# EAGLE design CANreader-XL (EAGLE 7.6.0)
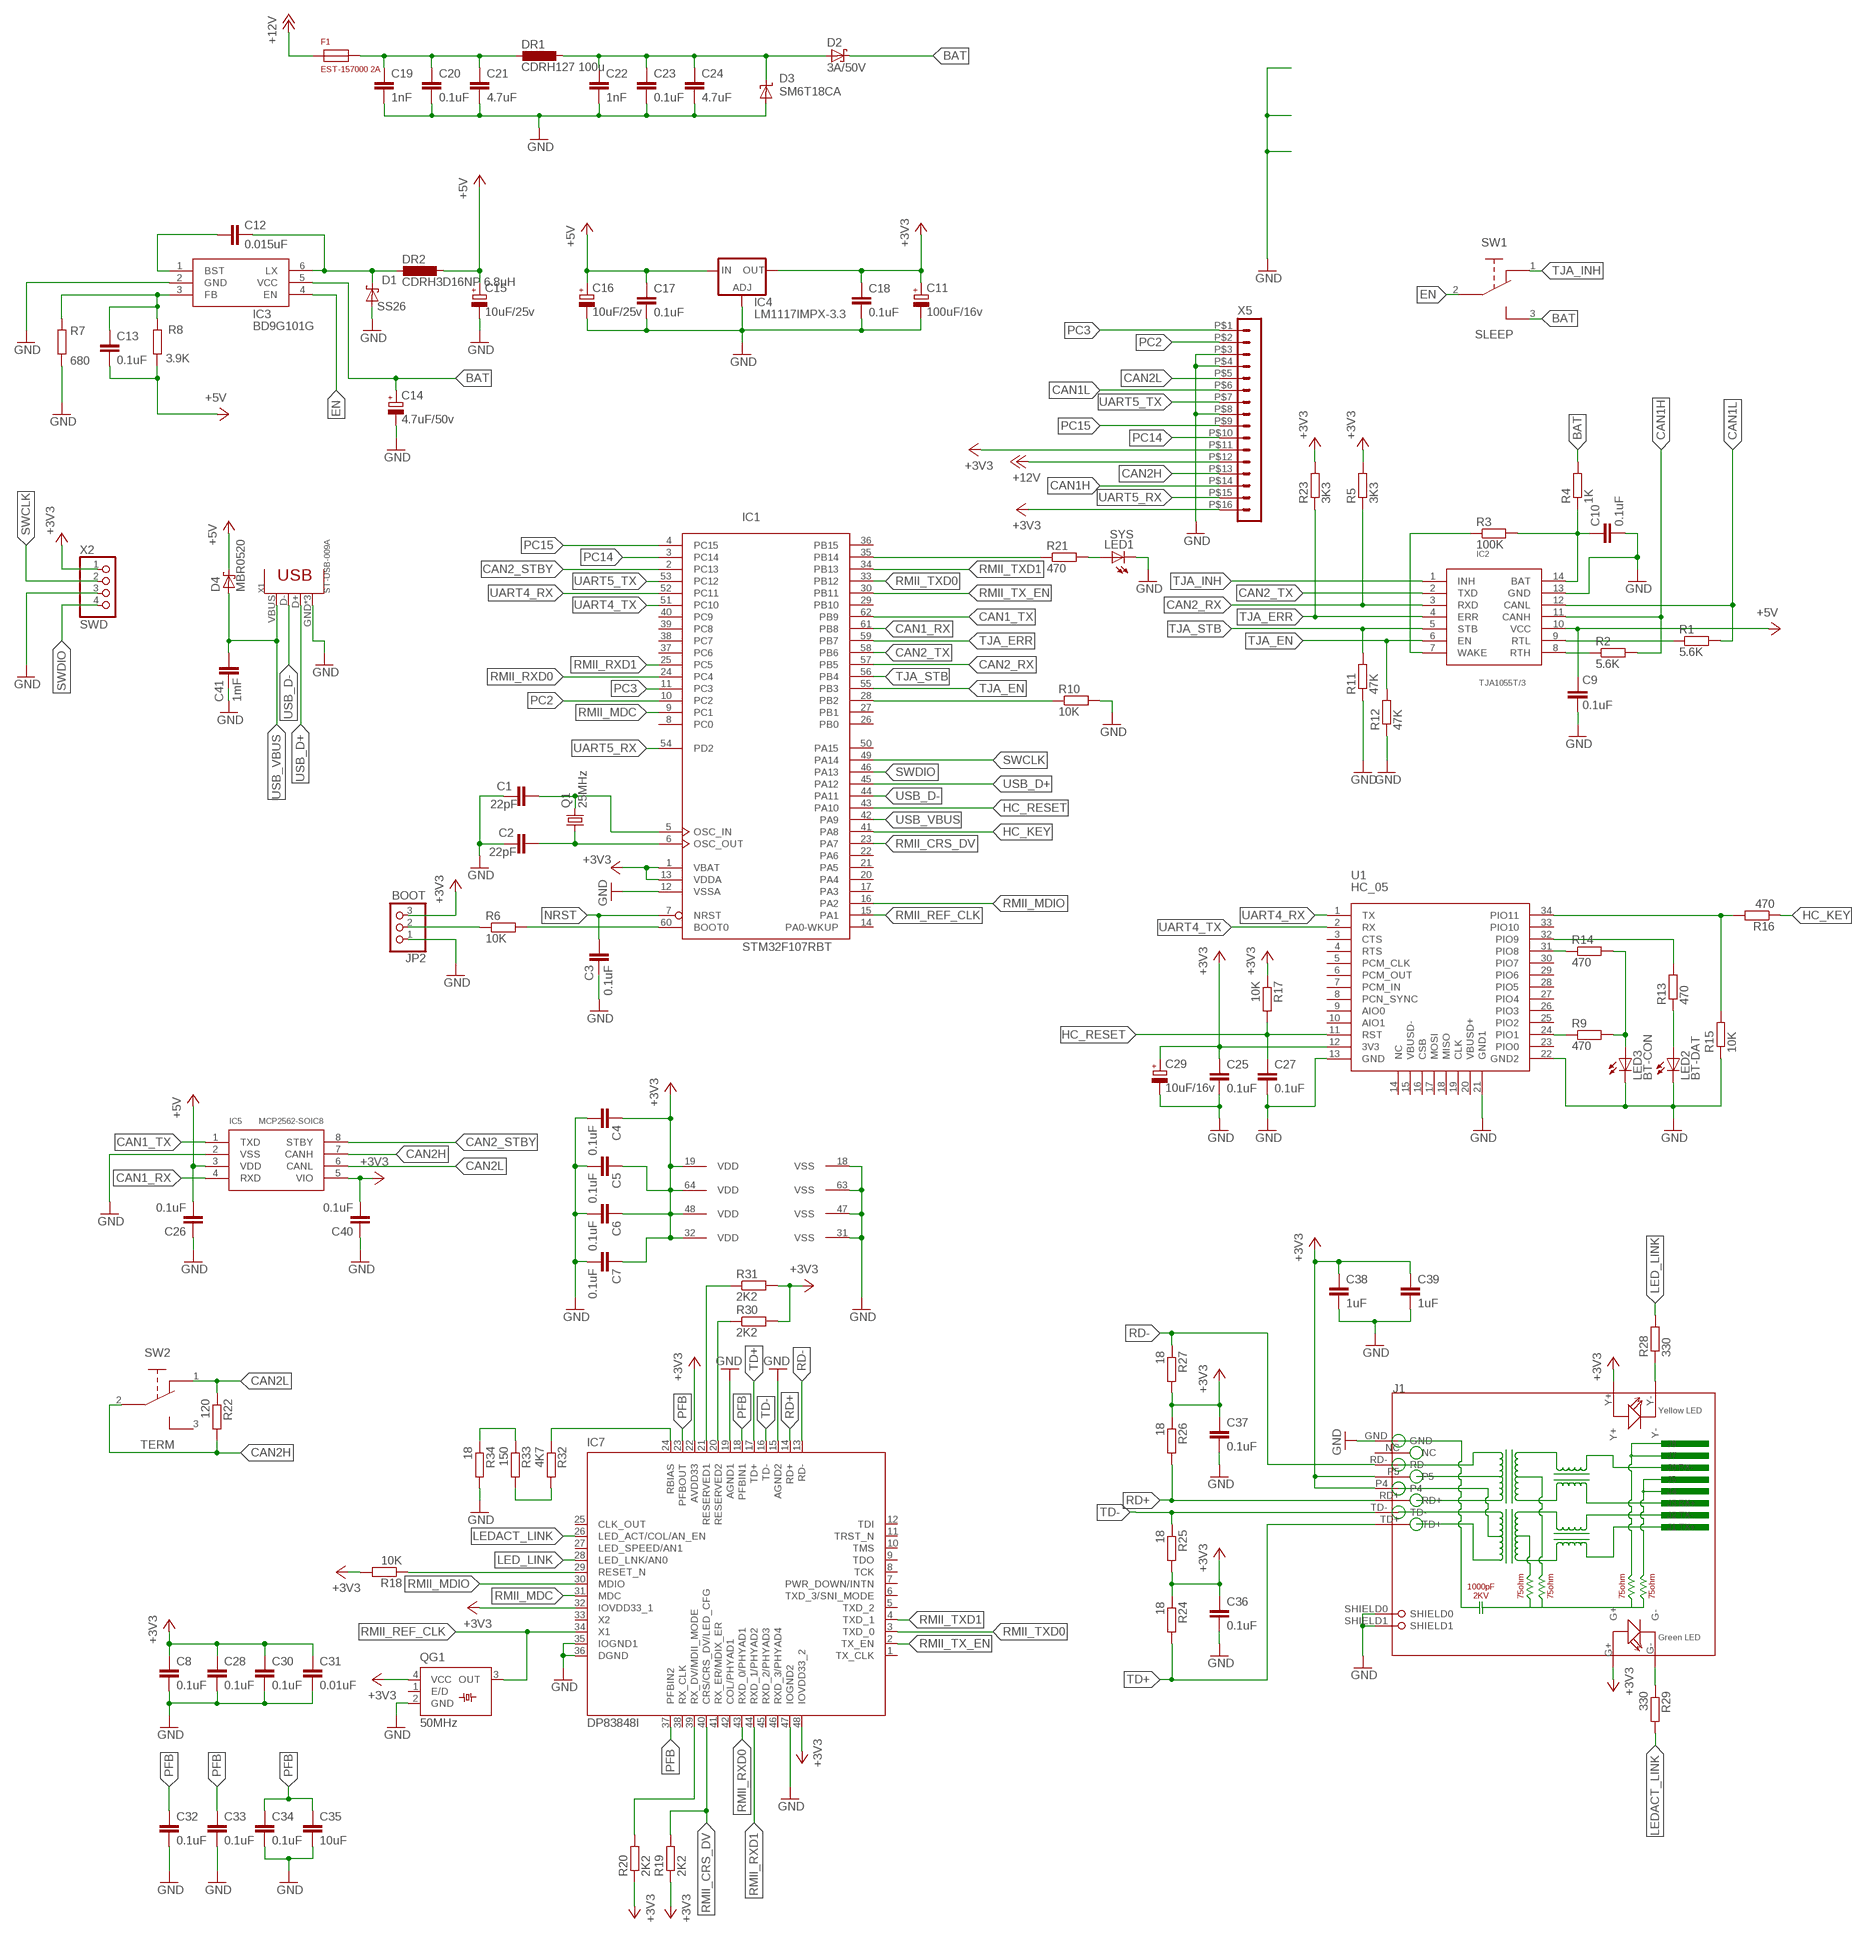
[diagram p0: schematic, sheet 1]

## Parts
C1  22pF  C-EUC0805  [C0805]
C2  22pF  C-EUC0805  [C0805]
C3  0.1uF  C-EUC0805  [C0805]
C4  0.1uF  C-EUC0805  [C0805]
C5  0.1uF  C-EUC0805  [C0805]
C6  0.1uF  C-EUC0805  [C0805]
C7  0.1uF  C-EUC0805  [C0805]
C8  0.1uF  C-EUC0805  [C0805]
C9  0.1uF  C-EUC0805  [C0805]
C10  0.1uF  C-EUC0805  [C0805]
C11  100uF/16v  CPOL-EUSMCD  [SMC_D]
C12  0.015uF  C-EUC0805  [C0805]
C13  0.1uF  C-EUC0805  [C0805]
C14  4.7uF/50v  CPOL-EU153CLV-0505  [153CLV-0505]
C15  10uF/25v  CPOL-EUSMCC  [SMC_C]
C16  10uF/25v  CPOL-EUSMCC  [SMC_C]
C17  0.1uF  C-EUC0805  [C0805]
C18  0.1uF  C-EUC0805  [C0805]
C19  1nF  C-EUC0805  [C0805]
C20  0.1uF  C-EUC0805  [C0805]
C21  4.7uF  C-EUC0805  [C0805]
C22  1nF  C-EUC0805  [C0805]
C23  0.1uF  C-EUC0805  [C0805]
C24  4.7uF  C-EUC0805  [C0805]
C25  0.1uF  C-EUC0805  [C0805]
C26  0.1uF  C-EUC0805  [C0805]
C27  0.1uF  C-EUC0805  [C0805]
C28  0.1uF  C-EUC0805  [C0805]
C29  10uF/16v  CPOL-EUSMCA  [SMC_A]
C30  0.1uF  C-EUC0805  [C0805]
C31  0.01uF  C-EUC0805  [C0805]
C32  0.1uF  C-EUC0805  [C0805]
C33  0.1uF  C-EUC0805  [C0805]
C34  0.1uF  C-EUC0805  [C0805]
C35  10uF  C-EUC0805  [C0805]
C36  0.1uF  C-EUC0805  [C0805]
C37  0.1uF  C-EUC0805  [C0805]
C38  1uF  C-EUC0805  [C0805]
C39  1uF  C-EUC0805  [C0805]
C40  0.1uF  C-EUC0805  [C0805]
C41  1mF  C-EUC0805  [C0805]
D1  SS26  SCHOTTKY-DIODESMD  [SMB]
D2  3A/50V  SCHOTTKY-DIODESMC  [SMC]
D3  SM6T18CA  SUPPRESSOR-SMBJ  [SMBJ]
D4  MBR0520  [SOD123]
DR1  CDRH127 100u  CDRH127  [MS85]
DR2  CDRH3D16NP 6.8uH  CDRH3D16NP  [CDRH3D16NP]
F1  EST-157000 2A  FUSE  [FUSE]
IC1  STM32F107RBT  [LQFP64]
IC2  TJA1055T/3  TJA1054T  [SO-14W]
IC3  BD9G101G  [SSOP6]
IC4  LM1117IMPX-3.3  [SOT223]
IC5  MCP2562-SOIC8  [SOIC8-1.27-5X4MM]
IC7  DP83848I  [LQFP48]
J1  RJ45-HR911105A-HR911105A  [RJ45]
JP2  BOOT  PINHD-1X3  [1X03]
LED1  SYS  LED3MM  [LED3MM]
LED2  BT-DAT  LED3MM  [LED3MM]
LED3  BT-CON  LED3MM  [LED3MM]
Q1  25MHz  CRYSTALHC49S  [HC49/S]
QG1  50MHz  SM77H  [SM77H]
R1  5.6K  R-EU_R0805  [R0805]
R2  5.6K  R-EU_R0805  [R0805]
R3  100K  R-EU_R0805  [R0805]
R4  1K  R-EU_R0805  [R0805]
R5  3K3  R-EU_R0805  [R0805]
R6  10K  R-EU_R0805  [R0805]
R7  680  R-EU_R0805  [R0805]
R8  3.9K  R-EU_R0805  [R0805]
R9  470  R-EU_R0805  [R0805]
R10  10K  R-EU_R0805  [R0805]
R11  47K  R-EU_R0805  [R0805]
R12  47K  R-EU_R0805  [R0805]
R13  470  R-EU_R0805  [R0805]
R14  470  R-EU_R0805  [R0805]
R15  10K  R-EU_R0805  [R0805]
R16  470  R-EU_R0805  [R0805]
R17  10K  R-EU_R0805  [R0805]
R18  10K  R-EU_R0805  [R0805]
R19  2K2  R-EU_R0805  [R0805]
R20  2K2  R-EU_R0805  [R0805]
R21  470  R-EU_R0805  [R0805]
R22  120  R-EU_R0805  [R0805]
R23  3K3  R-EU_R0805  [R0805]
R24  18  R-EU_R0805  [R0805]
R25  18  R-EU_R0805  [R0805]
R26  18  R-EU_R0805  [R0805]
R27  18  R-EU_R0805  [R0805]
R28  330  R-EU_R0805  [R0805]
R29  330  R-EU_R0805  [R0805]
R30  2K2  R-EU_R0805  [R0805]
R31  2K2  R-EU_R0805  [R0805]
R32  4K7  R-EU_R0805  [R0805]
R33  150  R-EU_R0805  [R0805]
R34  18  R-EU_R0805  [R0805]
SW1  SLEEP  SS12F27  [SS12F27]
SW2  TERM  SS12F27  [SS12F27]
U1  HC_05  [BLUETOOTH_SMD]
X1  ST-USB-009A  DIP-USB-B-TYPE-FMAL(4+2P-2.5-90D)  [USB4+2-2.5-90D]
X2  SWD  PINHD-1X4  [1X04]
X5  HEADER_POS16_43045-1600  [43045-1600]

## Nets
+3V3: C4.1 C5.1 C6.1 C7.1 C8.1 C11.+ C18.1 C25.1 C28.1 C29.+ C30.1 C31.1 C36.1 C37.1 C38.1 C39.1 C40.2 IC1.1(VBAT) IC1.13(VDDA) IC1.19(VDD) IC1.32(VDD) IC1.48(VDD) IC1.64(VDD) IC4.2(OUT) IC4.4(OUT) IC5.5(VIO) IC7.22(AVDD33) IC7.32(IOVDD33_1) IC7.48(IOVDD33_2) J1.G+ J1.P4 J1.P5 J1.Y+ JP2.3 QG1.4(VCC) R5.2 R17.1 R18.2 R19.1 R20.1 R23.2 R24.1 R25.2 R26.1 R27.2 R30.2 R31.2 U1.12(3V3) X2.1 X5.P$11 X5.P$16
+5V: C9.1 C13.2 C15.+ C16.+ C17.1 C26.2 D4.C DR2.P$2 IC2.10(VCC) IC4.3(IN) IC5.3(VDD) R8.1
+12V: F1.P$1 X5.P$12
BAT: C14.+ D2.C IC3.5(VCC) R4.2 SW1.3
BAT1: C22.1 C23.1 C24.1 D2.A D3.C DR1.P$2
BD9-FB: C13.1 IC3.3(FB) R7.2 R8.2
CAN1_RX: IC1.61(PB8) IC5.4(RXD)
CAN1_TX: IC1.62(PB9) IC5.1(TXD)
CAN1H: IC2.11(CANH) R2.2 X5.P$14
CAN1L: IC2.12(CANL) R1.2 X5.P$6
CAN2_RX: IC1.57(PB5) IC2.3(RXD) R5.1
CAN2_STBY: IC1.2(PC13) IC5.8(STBY)
CAN2_TX: IC1.58(PB6) IC2.2(TXD)
CAN2H: IC5.7(CANH) R22.2 SW2.2 X5.P$13
CAN2L: IC5.6(CANL) R22.1 SW2.1 X5.P$5
EN: IC3.4(EN) SW1.2
GND: C1.2 C2.2 C3.1 C4.2 C5.2 C6.2 C7.2 C8.2 C9.2 C10.2 C11.- C14.- C15.- C16.- C17.2 C18.2 C19.2 C20.2 C21.2 C22.2 C23.2 C24.2 C25.2 C26.1 C27.2 C28.2 C29.- C30.2 C31.2 C32.2 C33.2 C34.2 C35.2 C36.2 C37.2 C38.2 C39.2 C40.1 C41.2 D1.A D3.A IC1.12(VSSA) IC1.18(VSS) IC1.31(VSS) IC1.47(VSS) IC1.63(VSS) IC2.13(GND) IC3.2(GND) IC4.1(ADJ) IC5.2(VSS) IC7.15(AGND2) IC7.19(AGND1) IC7.35(IOGND1) IC7.36(DGND) IC7.47(IOGND2) J1.GND J1.SHIELD0 J1.SHIELD1 JP2.1 LED1.K(C) LED2.K(C) LED3.K(C) QG1.2(GND) R7.1 R10.2 R11.1 R12.1 R15.1 R34.2 U1.13(GND) U1.21(GND1) U1.22(GND2) X1.GND X1.S1 X1.S2 X2.3 X5.P$3 X5.P$4 X5.P$8
HC_KEY: IC1.41(PA8) R16.1
HC_RESET: C27.1 IC1.43(PA10) R17.2 U1.11(RST)
LED_LINK: IC7.28(LED_LNK/AN0) R28.2
LEDACT_LINK: IC7.26(LED_ACT/COL/AN_EN) R29.2
N$1: C1.1 IC1.5(OSC_IN) Q1.2
N$2: C2.1 IC1.6(OSC_OUT) Q1.1
N$3: IC1.60(BOOT0) R6.2
N$4: IC1.28(PB2) R10.1
N$5: R14.1 U1.31(PIO8)
N$6: IC1.35(PB14) R21.1
N$7: IC2.8(RTH) R2.1
N$8: IC2.9(RTL) R1.1
N$9: C12.1 IC3.1(BST)
N$10: R13.2 U1.32(PIO9)
N$11: LED2.A R13.1
N$12: C12.2 D1.C DR2.P$1 IC3.6(LX)
N$13: R9.1 U1.24(PIO1)
N$14: LED1.A R21.2
N$16: IC7.29(RESET_N) R18.1
N$17: IC7.20(RESERVED2) R30.1
N$18: C19.1 C20.1 C21.1 DR1.P$1 F1.P$2
N$20: IC7.39(RX_DV/MDII_MODE) R20.2
N$21: IC7.21(RESERVED1) R31.1
N$22: J1.G- R29.1
N$23: J1.Y- R28.1
N$25: R15.2 R16.2 U1.34(PIO11)
N$26: IC7.24(RBIAS) R32.1
N$27: R32.2 R33.2
N$28: R33.1 R34.1
N$29: JP2.2 R6.1
N$33: LED3.A R9.2 R14.2
NRST: C3.2 IC1.7(NRST)
PC2: IC1.10(PC2) X5.P$2
PC3: IC1.11(PC3) X5.P$1
PC14: IC1.3(PC14) X5.P$10
PC15: IC1.4(PC15) X5.P$9
PFB: C32.1 C33.1 C34.1 C35.1 IC7.18(PFBIN1) IC7.23(PFBOUT) IC7.37(PFBIN2)
RD+: IC7.14(RD+) J1.RD+ R26.2
RD-: IC7.13(RD-) J1.RD- R27.1
RMII_CRS_DV: IC1.23(PA7) IC7.40(CRS/CRS_DV/LED_CFG) R19.2
RMII_MDC: IC1.9(PC1) IC7.31(MDC)
RMII_MDIO: IC1.16(PA2) IC7.30(MDIO)
RMII_REF_CLK: IC1.15(PA1) IC7.34(X1) QG1.3(OUT)
RMII_RXD0: IC1.24(PC4) IC7.43(RXD_0/PHYAD1)
RMII_RXD1: IC1.25(PC5) IC7.44(RXD_1/PHYAD2)
RMII_TX_EN: IC1.30(PB11) IC7.2(TX_EN)
RMII_TXD0: IC1.33(PB12) IC7.3(TXD_0)
RMII_TXD1: IC1.34(PB13) IC7.4(TXD_1)
SWCLK: IC1.49(PA14) X2.2
SWDIO: IC1.46(PA13) X2.4
TD+: IC7.17(TD+) J1.TD+ R24.2
TD-: IC7.16(TD-) J1.TD- R25.1
TJA_EN: IC1.55(PB3) IC2.6(EN) R12.2
TJA_ERR: IC1.59(PB7) IC2.4(ERR) R23.1
TJA_INH: IC2.1(INH) SW1.1
TJA_STB: IC1.56(PB4) IC2.5(STB) R11.2
TJABAT: C10.1 IC2.14(BAT) R3.2 R4.1
TJAWAKE: IC2.7(WAKE) R3.1
UART4_RX: IC1.52(PC11) U1.1(TX)
UART4_TX: IC1.51(PC10) U1.2(RX)
UART5_RX: IC1.54(PD2) X5.P$15
UART5_TX: IC1.53(PC12) X5.P$7
USB_D+: IC1.45(PA12) X1.D+
USB_D-: IC1.44(PA11) X1.D-
USB_VBUS: C41.1 D4.A IC1.42(PA9) X1.VBUS
Unconnected: IC1.8(PC0) IC1.14(PA0-WKUP) IC1.17(PA3) IC1.20(PA4) IC1.21(PA5) IC1.22(PA6) IC1.26(PB0) IC1.27(PB1) IC1.29(PB10) IC1.36(PB15) IC1.37(PC6) IC1.38(PC7) IC1.39(PC8) IC1.40(PC9) IC1.50(PA15) IC7.1(TX_CLK) IC7.5(TXD_2) IC7.6(TXD_3/SNI_MODE) IC7.7(PWR_DOWN/INTN) IC7.8(TCK) IC7.9(TDO) IC7.10(TMS) IC7.11(TRST_N) IC7.12(TDI) IC7.25(CLK_OUT) IC7.27(LED_SPEED/AN1) IC7.33(X2) IC7.38(RX_CLK) IC7.41(RX_ER/MDIX_ER) IC7.42(COL/PHYAD1) IC7.45(RXD_2/PHYAD3) IC7.46(RXD_3/PHYAD4) J1.NC QG1.1(E/D) SW2.3 U1.3(CTS) U1.4(RTS) U1.5(PCM_CLK) U1.6(PCM_OUT) U1.7(PCM_IN) U1.8(PCN_SYNC) U1.9(AIO0) U1.10(AIO1) U1.14(NC) U1.15(VBUSD-) U1.16(CSB) U1.17(MOSI) U1.18(MISO) U1.19(CLK) U1.20(VBUSD+) U1.23(PIO0) U1.25(PIO2) U1.26(PIO3) U1.27(PIO4) U1.28(PIO5) U1.29(PIO6) U1.30(PIO7) U1.33(PIO10)

## Library data of the parts
C1-C10 C12 C13 C17-C28 C30-C41 = rcl:C-EU: CAPACITOR, European symbol
C11 C14-C16 C29 = rcl:CPOL-EU: POLARIZED CAPACITOR, European symbol
D1 = STM32_CAN-USB:SCHOTTKY-DIODE: Schottky Diode
D2 = diode:SCHOTTKY-DIODE: Schottky Diode
D3 = diode:SUPPRESSOR-: Suppressor diode
D4 = STM32_CAN-USB:MBR0520
DR1 = STM32_CAN-USB:CDRH127
DR2 = STM32_CAN-USB:CDRH3D16NP
F1 = STM32_CAN-USB:FUSE
IC1 = micro-stm_v2:STM32F107R*T: ARM 32-bit Cortex™-M3 CPU 72 MHz maximum frequency 128 to 256 Kbytes of Flash memory 64 kbytes of SRAM 51 GPIOs 2.0 to 3.6 V application supply
IC2 = STM32_CAN-USB:TJA1054T
IC3 = STM32_CAN-USB:BD9G101G
IC4 = STM32_CAN-USB:LM1117IMPX-3.3
IC5 = STM32_CAN-USB:MCP2562-SOIC8
IC7 = STM32_CAN-USB:DP83848I: PHYTER® - Extended Temperature Single Port 10/100 Mb/s Ethernet Physical Layer Transceiver Auto generated by make-symbol-device-package-bsdl.ulp Rev. 34 Source: dp83848yb.bsdl http://www.national.com/ds/DP/DP83848VYB.pdf; MPN: DP83848VYB; OC_FARNELL: 1286817; OC_NEWARK: 11N4484
J1 = Connector:RJ45-HR911105A
JP2 = STM32_CAN-USB:PINHD-1X3: PIN HEADER
LED1-LED3 = led:LED: LED OSRAM: - CHIPLED LG R971, LG N971, LY N971, LG Q971, LY Q971, LO R971, LY R971 LH N974, LH R974 LS Q976, LO Q976, LY Q976 LO Q996 - Hyper CHIPLED LW Q18S LB Q993, LB Q99A, LB R99A - SideLED LS A670, LO A670, LY A670, LG A670, LP A670 LB A673, LV A673, LT A673, LW A673 LH A674 LY A675 LS A676, LA A676, LO A676, LY A676, LW A676 LS A679, LY A679, LG A679 - Hyper Micro SIDELED® LS Y876, LA Y876, LO Y876, LY Y876 LT Y87S - SmartLED LW L88C, LW L88S LB L89C, LB L89S, LG L890 LS L89K, LO L89K, LY L89K LS L896, LA L896, LO L896, LY L896 - TOPLED LS T670, LO T670, LY T670, LG T670, LP T670 LSG T670, LSP T670, LSY T670, LOP T670, LYG T670 LG T671, LOG T671, LSG T671 LB T673, LV T673, LT T673, LW T673 LH T674 LS T676, LA T676, LO T676, LY T676, LB T676, LH T676, LSB T676, LW T676 LB T67C, LV T67C, LT T67C, LS T67K, LO T67K, LY T67K, LW E67C LS E67B, LA E67B, LO E67B, LY E67B, LB E67C, LV E67C, LT E67C LW T67C LS T679, LY T679, LG T679 LS T770, LO T770, LY T770, LG T770, LP T770 LB T773, LV T773, LT T773, LW T773 LH T774 LS E675, LA E675, LY E675, LS T675 LS T776, LA T776, LO T776, LY T776, LB T776 LHGB T686 LT T68C, LB T68C - Hyper Mini TOPLED® LB M676 - Mini TOPLED Santana® LG M470 LS M47K, LO M47K, LY M47K Source: http://www.osram.convergy.de LUXEON: - LUMILED® LXK2-PW12-R00, LXK2-PW12-S00, LXK2-PW14-U00, LXK2-PW14-V00 LXK2-PM12-R00, LXK2-PM12-S00, LXK2-PM14-U00 LXK2-PE12-Q00, LXK2-PE12-R00, LXK2-PE12-S00, LXK2-PE14-T00, LXK2-PE14-U00 LXK2-PB12-K00, LXK2-PB12-L00, LXK2-PB12-M00, LXK2-PB14-N00, LXK2-PB14-P00, LXK2-PB14-Q00 LXK2-PR12-L00, LXK2-PR12-M00, LXK2-PR14-Q00, LXK2-PR14-R00 LXK2-PD12-Q00, LXK2-PD12-R00, LXK2-PD12-S00 LXK2-PH12-R00, LXK2-PH12-S00 LXK2-PL12-P00, LXK2-PL12-Q00, LXK2-PL12-R00 Source: www.luxeon.com KINGBRIGHT: KA-3528ASYC Source: www.kingbright.com
Q1 = crystal:CRYSTAL: CRYSTAL; OC_FARNELL: 1667008; OC_NEWARK: unknown
QG1 = crystal:SM77H: 3.3V CMOS Clock Oscillator Source: www.pletronics.com .. sm77h%203.3v.pdf; OC_FARNELL: unknown; OC_NEWARK: unknown
R1-R34 = rcl:R-EU_: RESISTOR, European symbol
SW1 SW2 = STM32_CAN-USB:SS12F27
U1 = Bluetooth HC-05:HC_05: HC-05 Bluetooth Module
X1 = Seeed-OPL-Connector:DIP-USB-B-TYPE-FMAL(4+2P-2.5-90D): 320010018; MPN: ST-USB-009A
X2 = STM32_CAN-USB:PINHD-1X4: PIN HEADER
X5 = con-molex-micro-fit-3_0:HEADER_POS16_?: Molex - Micro-Fit 3.0 Series connector, 3.00mm (0.118") pitch header, 16 positions.

## Board
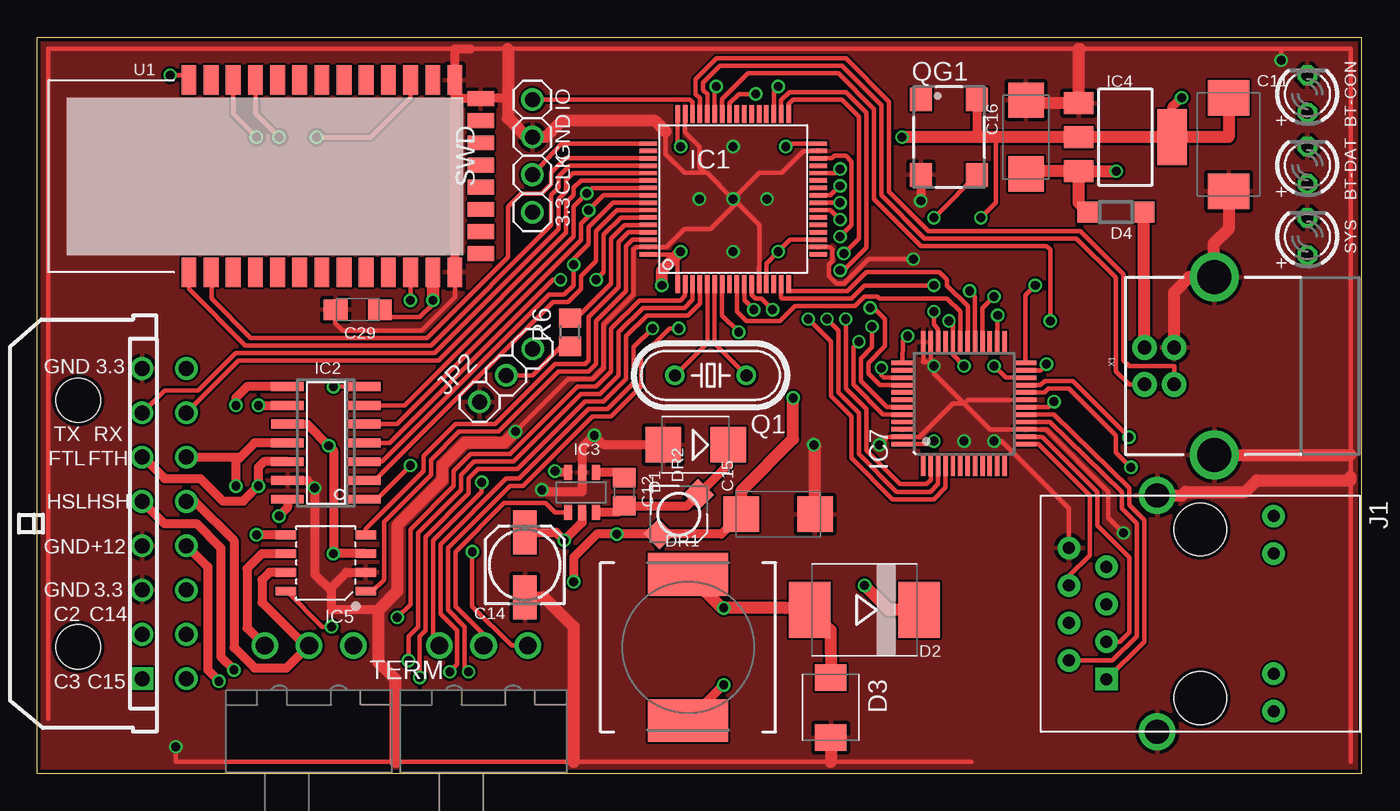
[diagram p1: board, top side]
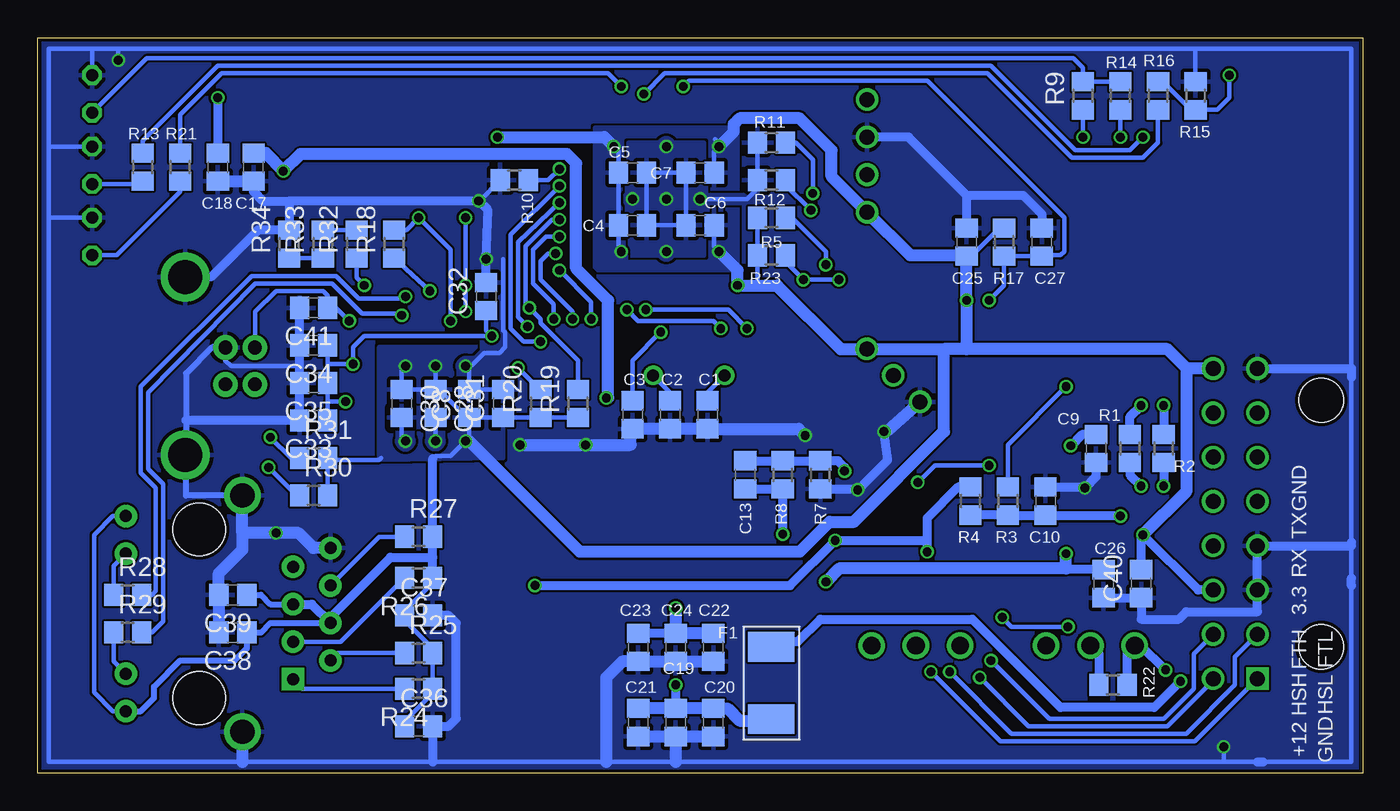
[diagram p2: board, bottom side, seen from below]

Size 89.66 x 49.78 mm. Coordinates in mm from the lower left corner, seen from the top.
Outline: 0,0 89.66,0 89.66,49.78 0,49.78 0,0
Copper layers (1*16): Top 0.035mm / dielectric 1.5mm / Bottom 0.035mm
Design rules "ITead_rule": minimum track width 6mil, minimum drill 12mil, track to track 6mil, track to pad 6mil, pad to pad 6mil, via to via 6mil, smd to smd 0mil, copper to edge 10mil, drill to drill 10mil, minimum pad ring 10mil, minimum via ring 6mil, stop-mask expansion 2mil, vias tented up to drill 100mil, thermal gap 10mil

### Footprints (pad centres in the part's own frame; a part is rotated, then mirrored left to right if it is on the bottom)
C0805 = smd 1.3 x 1.5: 1 -0.95,0; 2 0.95,0
SMC_D = smd 2.4 x 2.8: + -3.15,0; - 3.15,0
153CLV-0505 = smd 3 x 1.6: + 2.2,0; - -2.2,0
SMC_C = smd 2.4 x 2.4: + -2.5,0; - 2.5,0
SMC_A = smd 1.6 x 1.4: + -1.5,0; - 1.5,0
SMB = smd 2.4 x 2.4: A 2.2,0; C -2.2,0
SMC = smd 2.8 x 3.8: A 3.7,0; C -3.7,0
SMBJ = smd 1.78 x 2.16: A 2.04,0; C -2.03,0
SOD123 = smd 1.4 x 1.4: A 1.9,0; C -1.9,0
MS85 = smd 5.4 x 2.9: P$1 0,4.95; P$2 0,-4.95
CDRH3D16NP = smd 1.5 x 1.4 rotated 45: P$1 -1.349,1.349; P$2 1.349,-1.349
FUSE = smd 2 x 3.15: P$1 -2.45,0; P$2 2.45,0
LQFP64 = smd 0.3 x 1.2: 1 -3.75,-5.75; 2 -3.25,-5.75; 3 -2.75,-5.75; 4 -2.25,-5.75; 5 -1.75,-5.75; 6 -1.25,-5.75; 7 -0.75,-5.75; 8 -0.25,-5.75; 9 0.25,-5.75; 10 0.75,-5.75; 11 1.25,-5.75; 12 1.75,-5.75; 13 2.25,-5.75; 14 2.75,-5.75; 15 3.25,-5.75; 16 3.75,-5.75; 33 3.75,5.75; 34 3.25,5.75; 35 2.75,5.75; 36 2.25,5.75; 37 1.75,5.75; 38 1.25,5.75; 39 0.75,5.75; 40 0.25,5.75; 41 -0.25,5.75; 42 -0.75,5.75; 43 -1.25,5.75; 44 -1.75,5.75; 45 -2.25,5.75; 46 -2.75,5.75; 47 -3.25,5.75; 48 -3.75,5.75 | smd 1.2 x 0.3: 17 5.75,-3.75; 18 5.75,-3.25; 19 5.75,-2.75; 20 5.75,-2.25; 21 5.75,-1.75; 22 5.75,-1.25; 23 5.75,-0.75; 24 5.75,-0.25; 25 5.75,0.25; 26 5.75,0.75; 27 5.75,1.25; 28 5.75,1.75; 29 5.75,2.25; 30 5.75,2.75; 31 5.75,3.25; 32 5.75,3.75; 49 -5.75,3.75; 50 -5.75,3.25; 51 -5.75,2.75; 52 -5.75,2.25; 53 -5.75,1.75; 54 -5.75,1.25; 55 -5.75,0.75; 56 -5.75,0.25; 57 -5.75,-0.25; 58 -5.75,-0.75; 59 -5.75,-1.25; 60 -5.75,-1.75; 61 -5.75,-2.25; 62 -5.75,-2.75; 63 -5.75,-3.25; 64 -5.75,-3.75
SO-14W = smd 0.6 x 2.2: 1 -3.81,-2.6; 2 -2.54,-2.6; 3 -1.27,-2.6; 4 0,-2.6; 5 1.27,-2.6; 6 2.54,-2.6; 7 3.81,-2.6; 8 3.81,2.6; 9 2.54,2.6; 10 1.27,2.6; 11 0,2.6; 12 -1.27,2.6; 13 -2.54,2.6; 14 -3.81,2.6
SSOP6 = smd 0.55 x 1: 1 0,-2.7; 2 0.95,-2.7; 3 1.9,-2.7; 4 1.9,0; 5 0.95,0; 6 0,0
SOT223 = smd 1.5 x 2: 1 -2.3,-3.15; 2 0,-3.15; 3 2.3,-3.15 | smd 3.8 x 2: 4 0,3.15
SOIC8-1.27-5X4MM = smd 0.6 x 1.4: 1 -1.905,-2.7; 2 -0.635,-2.7; 3 0.635,-2.7; 4 1.905,-2.7; 5 1.905,2.7; 6 0.635,2.7; 7 -0.635,2.7; 8 -1.905,2.7
LQFP48 = smd 1.5 x 0.3: 1 -4.15,2.75; 2 -4.15,2.25; 3 -4.15,1.75; 4 -4.15,1.25; 5 -4.15,0.75; 6 -4.15,0.25; 7 -4.15,-0.25; 8 -4.15,-0.75; 9 -4.15,-1.25; 10 -4.15,-1.75; 11 -4.15,-2.25; 12 -4.15,-2.75; 25 4.15,-2.75; 26 4.15,-2.25; 27 4.15,-1.75; 28 4.15,-1.25; 29 4.15,-0.75; 30 4.15,-0.25; 31 4.15,0.25; 32 4.15,0.75; 33 4.15,1.25; 34 4.15,1.75; 35 4.15,2.25; 36 4.15,2.75 | smd 0.3 x 1.5: 13 -2.75,-4.15; 14 -2.25,-4.15; 15 -1.75,-4.15; 16 -1.25,-4.15; 17 -0.75,-4.15; 18 -0.25,-4.15; 19 0.25,-4.15; 20 0.75,-4.15; 21 1.25,-4.15; 22 1.75,-4.15; 23 2.25,-4.15; 24 2.75,-4.15; 37 2.75,4.15; 38 2.25,4.15; 39 1.75,4.15; 40 1.25,4.15; 41 0.75,4.15; 42 0.25,4.15; 43 -0.25,4.15; 44 -0.75,4.15; 45 -1.25,4.15; 46 -1.75,4.15; 47 -2.25,4.15; 48 -2.75,4.15
RJ45 = drill 0.813 pad 1.524: G+ 4.953,-6.604; G- 4.953,-4.064; GND -8.89,4.445; NC -6.35,3.175; P4 -8.89,-0.635; P5 -6.35,0.635; RD+ -6.35,-1.905; RD- -8.89,1.905; TD- -8.89,-3.175; Y+ 4.953,6.604; Y- 4.953,4.064 | drill 1.651 pad 2.159: SHIELD0 -2.921,8.001; SHIELD1 -2.921,-8.001 | drill 0.813 pad 1.524 square: TD+ -6.35,-4.445 | hole 3.556: 0,-5.715; 0,5.715
1X03 = drill 1.016: 1 -2.54,0; 2 0,0; 3 2.54,0
LED3MM = drill 0.813 octagon: A -1.27,0; K 1.27,0
HC49/S = drill 0.813: 1 -2.413,0; 2 2.413,0
SM77H = smd 1.6 x 1.5: 1 -2.55,-1.9; 2 2.55,-1.9; 3 2.55,1.9; 4 -2.55,1.9
R0805 = smd 1.3 x 1.5: 1 -0.95,0; 2 0.95,0
SS12F27 = drill 1.2: 1 -3,0; 2 0,0; 3 3,0
BLUETOOTH_SMD = smd 2 x 1: 1 -6.35,3.81; 2 -6.35,2.31; 3 -6.35,0.81; 4 -6.35,-0.69; 5 -6.35,-2.19; 6 -6.35,-3.69; 7 -6.35,-5.19; 8 -6.35,-6.69; 9 -6.35,-8.19; 10 -6.35,-9.69; 11 -6.35,-11.19; 12 -6.35,-12.69; 13 -6.35,-14.19; 22 6.65,-14.19; 23 6.65,-12.69; 24 6.65,-11.19; 25 6.65,-9.69; 26 6.65,-8.19; 27 6.65,-6.69; 28 6.65,-5.19; 29 6.65,-3.69; 30 6.65,-2.19; 31 6.65,-0.69; 32 6.65,0.81; 33 6.65,2.31; 34 6.65,3.81 | smd 1 x 1.8: 14 -5.1,-15.94; 15 -3.6,-15.94; 16 -2.1,-15.94; 17 -0.6,-15.94; 18 0.9,-15.94; 19 2.4,-15.94; 20 3.9,-15.94; 21 5.4,-15.94
USB4+2-2.5-90D = drill 0.914 pad 1.676: D+ 0,1.25; D- 2,1.25; GND 0,-1.25; VBUS 2,-1.25 | drill 2.286: S1 -2.71,-6.02; S2 -2.71,6.02
1X04 = drill 1.016: 1 -3.81,0; 2 -1.27,0; 3 1.27,0; 4 3.81,0
43045-1600 = drill 1.02 square: P$1 10.5,4.32 | drill 1.02: P$2 7.5,4.32; P$3 4.5,4.32; P$4 1.5,4.32; P$5 -1.5,4.32; P$6 -4.5,4.32; P$7 -7.5,4.32; P$8 -10.5,4.32; P$9 10.5,7.32; P$10 7.5,7.32; P$11 4.5,7.32; P$12 1.5,7.32; P$13 -1.5,7.32; P$14 -4.5,7.32; P$15 -7.5,7.32; P$16 -10.5,7.32 | hole 3: 8.35,0; -8.35,0

### Placement (x,y rotation side)
C1  44.32,24.26 270 bottom
C2  46.86,24.26 270 bottom
C3  49.4,24.26 90 bottom
C4  49.4,37.08 0 bottom
C5  49.4,40.64 0 bottom
C6  44.83,37.08 180 bottom
C7  44.83,40.64 180 bottom
C8  60.45,25.02 90 bottom
C9  18.03,21.97 270 bottom
C10  21.46,18.41 90 bottom
C11  80.64,42.55 270 top
C12  39.75,19.05 270 top
C13  41.78,20.19 270 bottom
C14  33.02,14.1 90 top
C15  50.16,17.53 0 top
C16  66.93,43.05 90 top
C17  75.06,41.02 270 bottom
C18  77.47,41.02 270 bottom
C19  46.48,3.43 270 bottom
C20  43.94,3.43 270 bottom
C21  49.02,3.43 270 bottom
C22  43.94,8.51 270 bottom
C23  49.02,8.51 270 bottom
C24  46.48,8.51 270 bottom
C25  26.8,35.94 90 bottom
C26  17.53,12.83 90 bottom
C27  21.72,35.94 90 bottom
C28  62.74,25.02 270 bottom
C29  21.72,31.37 180 top
C30  65.02,25.02 270 bottom
C31  58.17,25.02 90 bottom
C32  59.31,32.26 90 bottom
C33  70.99,23.88 180 bottom
C34  70.99,28.96 180 bottom
C35  70.99,26.42 180 bottom
C36  63.88,3.17 0 bottom
C37  63.88,10.67 0 bottom
C38  76.45,9.53 180 bottom
C39  76.45,12.06 180 bottom
C40  14.99,12.83 90 bottom
C41  70.99,31.5 180 bottom
D1  44.58,22.23 180 top
D2  56.01,11.05 180 top
D3  53.72,4.45 270 top
D4  73.03,37.97 0 top
DR1  44.07,8.51 180 top
DR2  43.43,17.53 270 top
F1  40.01,6.1 270 bottom
IC1  47.12,38.86 0 top
IC2  19.56,22.35 90 top
IC3  37.85,17.65 180 top
IC4  73.66,43.05 270 top
IC5  19.56,14.22 90 top
IC7  62.74,25.02 90 top
J1  78.74,10.79 0 top
JP2  31.75,26.92 45 top
LED1  85.98,36.32 90 top
LED2  85.98,41.15 90 top
LED3  85.98,45.97 90 top
Q1  45.59,26.92 180 top
QG1  61.72,43.05 270 top
R1  15.75,21.97 270 bottom
R2  13.46,21.97 270 bottom
R3  24,18.41 270 bottom
R4  26.54,18.41 90 bottom
R5  40.01,37.59 180 bottom
R6  36.07,29.84 90 top
R7  36.7,20.19 90 bottom
R8  39.24,20.19 90 bottom
R9  18.92,45.85 90 bottom
R10  57.4,40.13 180 bottom
R11  40.01,40.13 0 bottom
R12  40.01,42.67 0 bottom
R13  82.55,41.02 90 bottom
R14  16.38,45.85 90 bottom
R15  11.3,45.85 270 bottom
R16  13.84,45.85 90 bottom
R17  24.26,35.94 270 bottom
R18  65.53,35.81 90 bottom
R19  53.09,25.02 90 bottom
R20  55.63,25.02 90 bottom
R21  80.01,41.02 270 bottom
R22  16.89,5.97 180 bottom
R23  40.01,35.05 180 bottom
R24  63.88,5.71 180 bottom
R25  63.88,8.13 0 bottom
R26  63.88,13.21 180 bottom
R27  63.88,16 0 bottom
R28  83.57,12.06 0 bottom
R29  83.57,9.53 0 bottom
R30  70.99,18.8 0 bottom
R31  70.99,21.34 0 bottom
R32  68.07,35.81 90 bottom
R33  70.36,35.81 90 bottom
R34  72.64,35.81 90 bottom
SW1  30.23,8.64 0 top
SW2  18.41,8.64 0 top
U1  14.1,40.26 90 top
X1  76.96,27.56 180 top
X2  33.53,41.78 90 top
X5  2.79,16.89 270 top

### Tracks (layer width: path | path; a pad name or v marks a point on that pad's centre or on a via)
+3V3  (via drill 0.6)
  Top 0.305: U1.12 | v26.8,32 26.8,31.75 25.91,30.86 23.73,30.86 C29.+ | IC1.64 43.37,35.11 | IC1.48 43.37,42.61 v43.56,42.42 | IC1.32 50.87,42.61 v50.67,42.42 | IC1.13 49.37,34.51 v50.16,35.31 50.97,36.11 IC1.19 | IC1.1 43.37,35.11 | 43.37,35.11 v43.56,35.31 | IC7.48 60.5,22.27 v60.71,22.48 | IC7.22 65.56,26.77 v64.77,27.56 | 61.98,29.16 IC7.32 61.99,29.71 61.98,29.72 | v62.74,27.56 61.98,28.32 61.98,29.72 | v63.88,37.59 64.9,38.61 64.9,43.05 | 61.98,29.72 61.98,30.35 v61.72,30.61
  Top 0.61: IC5.5 v14.86,16.13 | QG1.4 63.62,43.17 63.5,43.05 | IC4.4 76.81,45.11 v77.47,45.72
  Top 0.813: U1.12 v26.8,32 U1.12 | C11.+ 80.64,43.05 IC4.4 IC4.2 64.9,43.05 63.5,43.05 v58.55,43.05 | v43.56,35.31 42.48,34.23 42.41,34.13 42.29,34.01 v42.29,33.02
  Bottom 0.305: C25.1 26.48,34.99 24.58,36.89 R17.1 23.94,36.89 | 43.81,42.93 v43.56,42.42 43.88,42.1 C7.1 | v43.56,35.31 43.88,35.63 C6.1 | v50.16,35.31 50.35,35.49 C4.1 C5.1 50.35,42.1 v50.67,42.42 50.8,42.55 | C28.1 v62.74,27.56 | C28.1 C30.1 65.02,27.3 v64.77,27.56 | J1.G+ 84.58,4.19 85.85,5.46 85.85,16.13 84.58,17.4 J1.Y+ | R26.1 62.93,12.89 64.83,10.99 C37.1 64.83,10.35 62.93,8.45 R25.2 R24.1 62.93,5.39 64.83,3.5 C36.1 | 70.04,21.21 66.55,21.21 66.42,21.34 | 62.99,21.34 62.93,21.27 62.74,21.46 61.72,21.46 v60.71,22.48 60.45,22.73 C8.1 | R30.2 70.04,21.21 | 70.04,21.21 R31.2 | C8.1 60.65,24.07 62.55,25.97 C28.1 | C8.1 C31.1 R20.1 R19.1 | R5.2 R23.2 40.95,33.02 40.39,33.02 | R18.2 64.71,36.76 v63.88,37.59 61.72,35.43 v61.72,30.61
  Bottom 0.406: C39.1 74.55,12.06 73.91,11.43 J1.P5 | J1.P4 73.91,10.16 74.55,9.53 C38.1 75.5,8.44 76.33,7.62 80.01,7.62 81.79,5.84 81.79,5.08 82.68,4.19 J1.G+
  Bottom 0.61: C40.2 14.99,16 v14.86,16.13 11.12,12.39 X5.P$11 | R26.1 62.93,14.61 | 62.93,14.61 R27.2 62.93,21.27 | 62.93,14.61 65.79,14.61 69.85,10.54 J1.P4 71.12,11.43 J1.P5 | v77.47,45.72 C18.1
  Bottom 0.813: 26.8,28.7 v26.8,32 C25.1 | 26.8,28.7 13.21,28.7 11.94,27.43 | 28.32,28.7 28.32,23.11 34.42,17.02 36.07,17.02 38.1,14.99 52.96,14.99 60.45,22.48 v60.71,22.48 | 11.94,27.43 11.94,19.05 v14.86,16.13 | X5.P$16 11.9,27.39 11.94,27.43 | 26.8,35.05 30.61,35.05 X2.1 35.94,40.39 35.94,42.16 38.1,44.32 42.16,44.32 42.55,43.94 42.55,43.43 v43.56,42.42 | 26.8,28.7 28.32,28.7 | v58.55,43.05 51.31,43.05 v50.67,42.42 | 28.32,28.7 33.53,28.7 JP2.3 33.56,28.7 35.31,28.7 39.62,33.02 40.39,33.02 v42.29,33.02 42.29,34.04 v43.56,35.31
  pour Bottom (isolate 0.406): 58.17,28.83 66.55,28.83 66.55,21.21 58.17,21.34
  pour Bottom (isolate 0.406, rank 2): 42.29,43.69 51.94,43.69 51.94,34.04 42.29,34.04
+5V  (via drill 0.6)
  Top 0.61: IC2.10 18.29,23.62 v19.75,22.16 20.07,21.84 v20.07,14.86 IC5.3 | 66.93,40.75 C16.+ | v36.32,12.95 36.32,14.61 37.89,16.18 v39.24,16.18 DR2.P$2 46.32,16.18 C15.+
  Top 0.813: IC4.3 v73.04,40.75 | IC4.3 66.93,40.75 | D4.C 70.51,38.59 IC4.3 | C15.+ 47.66,19.09 51.18,22.61 v51.18,25.4
  Bottom 0.61: C9.1 18.99,22.92 v19.75,22.16 | C26.2 20,13.78 20.07,13.84 | C13.2 R8.1 v39.24,16.18
  Bottom 0.813: v20.07,14.86 20.07,13.84 35.43,13.84 v36.32,12.95 | C17.1 74.23,41.98 v73.04,40.75 71.88,41.91 53.85,41.91 53.21,41.27 53.21,34.16 51.05,32 51.05,25.4 v51.18,25.4
+12V  (via drill 0.6)
  Top 0.61: X5.P$12 10.14,15.39 11.56,13.97 11.56,6.99 v12.32,6.22
  Bottom 0.61: 39.5,8.89 38.23,8.89 36.7,10.41 26.42,10.41 20.45,4.45 14.1,4.45 v12.32,6.22
  Bottom 0.813: 39.5,8.89 F1.P$1
BAT  (via drill 0.6)
  Top 0.305: v29.46,14.99 29.46,11.3 32.13,8.64 SW1.3
  Top 0.61: IC3.5 36.9,16.96 v35.69,15.75 35.14,16.3 C14.+
  Top 0.813: D2.C 57.66,11.05 v56.01,12.7
  Bottom 0.61: v56.01,12.7 38.73,12.7 v35.69,15.75 29.46,15.75 | v29.46,14.99 29.46,15.75 | 29.46,15.75 29.46,17.27 27.37,19.36 R4.2
BAT1  (via drill 0.6)
  Top 0.813: DR1.P$2 46.35,11.18 v46.48,11.18 50.66,11.18 D2.A 53.7,9.67 D3.C
  Bottom 0.61: C24.1 C23.1
  Bottom 0.813: C22.1 C24.1 v46.48,11.18
BD9-FB  (via drill 0.6)
  Top 0.61: IC3.3 35.15,20.35 v35.05,20.45
  Bottom 0.61: C13.1 R8.2 R7.2 35.49,21.14 35.05,20.7 v35.05,20.45
CAN1_RX
  Top 0.305: IC1.61 40.04,36.61 39.37,35.94 39.37,32.89 37.34,30.86 37.34,27.94 37.08,27.69 35.05,27.69 30.99,23.62 28.32,23.62 26.16,21.46 26.16,20.45 22.26,16.54 IC5.4
CAN1_TX
  Top 0.305: IC1.62 40.3,36.11 39.88,35.69 39.88,32.64 37.85,30.61 37.85,27.69 37.34,27.18 35.31,27.18 31.24,23.11 28.57,23.11 26.67,21.21 26.67,20.19 23.5,17.02 23.5,13.08 22.73,12.32 IC5.1
CAN1H  (via drill 0.6)
  Top 0.61: IC2.11 14.73,22.35 13.77,21.39 | 13.77,21.39 13.46,21.08 v13.46,19.43 | X5.P$14 13.77,21.39
  Bottom 0.61: R2.2 v13.46,19.43
CAN1L  (via drill 0.6)
  Top 0.61: IC2.12 15.37,21.08 14.99,20.7 v14.99,19.43 13.97,18.41 12.57,18.41 11.05,19.94 8.64,19.94 7.18,21.39 X5.P$6
  Bottom 0.61: R1.2 15.75,20.19 v14.99,19.43
CAN2_RX  (via drill 0.6)
  Top 0.305: IC1.57 38.99,38.61 37.34,36.96 37.34,35.81 36.32,34.8 v36.32,34.42 36.32,33.02 35.69,32.38 34.67,32.38 23.37,21.08 IC2.3
  Bottom 0.305: v36.32,34.42 36.32,35.31 38.48,37.47 R5.1
CAN2_STBY  (via drill 0.6)
  Top 0.305: IC1.2 43.87,32.31 43.56,32 40.77,32 38.86,30.1 38.86,27.18 37.85,26.16 36.58,26.16 32,21.59 29.34,21.59 28.19,20.45 28.19,19.43 25.27,16.51 25.27,11.43 v24.38,10.54 | IC5.8 16.89,12.32 19.3,9.91 v19.94,9.91
  Bottom 0.305: v19.94,9.91 23.75,9.91 v24.38,10.54
CAN2_TX
  Top 0.305: IC1.58 39.26,38.11 37.85,36.7 37.85,34.67 36.83,33.66 36.83,32.77 35.94,31.88 34.92,31.88 22.86,19.81 IC2.2
CAN2H
  Top 0.61: IC5.7 15.75,13.59 15.24,13.08 15.24,11.56 18.16,8.64 SW2.2 16.89,7.11 14.73,7.11 13.34,8.51 13.34,15.75 10.69,18.39 X5.P$13
  Bottom 0.61: SW2.2 17.84,8.06 R22.2
CAN2L  (via drill 0.6)
  Top 0.61: SW2.1 14.22,9.83 14.22,13.84 15.24,14.86 IC5.6 | X5.P$5 8.61,16.89 10.79,16.89 12.45,15.24 12.45,7.87 v13.34,6.99
  Bottom 0.61: v13.34,6.99 15.03,8.64 SW2.1 15.94,8.11 R22.1
EN
  Top 0.305: SW1.2 30.23,9.4 28.32,11.3 28.32,14.99 31.62,18.29 34.42,18.29 35.05,17.65 IC3.4
GND  (via drill 0.6)
  Top 0.305: 88.9,0.76 88.9,19.81 | 88.9,20.07 88.9,21.54 88.9,49.02 84.2,49.02 | 63.24,0.76 53.72,0.76 36.32,0.76 24.26,0.76 9.4,0.76 v9.4,1.78 | 84.2,49.02 70.61,49.02 31.88,49.02 29.34,49.02 0.76,49.02 0.76,3.68 | U1.13 28.29,32.22 26.04,29.97 20.7,29.97 20.19,30.48 20.19,31.24 | IC1.47 43.87,43.38 44.83,42.42 44.83,41.02 45.21,40.64 | IC1.12 48.87,34.26 48.9,34.29 48.9,37.08 47.37,38.61 | 47.37,38.61 v47.12,38.86 | 47.37,38.61 45.59,36.83 43.81,36.83 42.6,35.61 IC1.63 40.56,35.61 40.39,35.43 40.39,32.38 38.35,30.35 38.35,27.43 37.59,26.67 35.94,26.67 v32.38,23.11 | IC1.31 51.89,42.11 50.42,40.64 48.9,40.64 v47.12,38.86 | 62.74,25.02 64.49,23.27 IC7.15 68.3,23.27 72.52,19.05 72.52,17.27 v73.53,16.26 | IC7.19 62.99,25.27 62.74,25.02 | v60.71,27.56 60.49,27.78 IC7.35 | 62.74,25.02 60.71,27.05 v60.71,27.56 | 62.74,25.02 61.98,25.02 59.73,22.77 IC7.47 57.57,22.77 v57.02,22.23 | IC7.36 59.99,27.86 59.94,27.81 60.45,27.81 v60.71,27.56 | 42.55,43.43 42.55,41.91 43.81,40.64 45.21,40.64 | 45.21,40.64 45.34,40.64 v47.12,38.86 | 84.2,49.02 v84.2,48.26 | v64.77,22.48 65.28,22.48 69.85,17.91 J1.GND | IC1.18 53.67,35.61 53.85,35.43 53.85,34.67 53.59,34.42 53.59,33.66 54.1,33.15 54.61,33.15 56.26,34.8 v59.31,34.8
  Top 0.61: U1.13 28.29,45.66 | 28.29,45.66 U1.22 28.29,49.02 29.34,49.02 | U1.21 28.29,45.66 | 19.94,12.32 19.94,11.05 23.11,11.05 | 19.94,12.32 19.94,12.57 20.95,13.59 IC5.2 | IC2.13 18.29,19.81 v18.8,19.3 18.8,13.46 19.94,12.32 | 29.84,45.72 31.88,45.72 | 66.93,45.35 C16.- | C29.- 20.22,31.27 20.19,31.24 | v34.16,19.18 34.29,19.05 36.9,19.05 IC3.2 36.9,22.04 v37.72,22.86 38.35,22.23 D1.A | C15.- 52.66,17.82 | QG1.2 59.82,40.38 v59.82,38.73
  Top 0.813: 31.88,49.02 31.88,45.72 31.88,44.32 33.15,43.05 X2.3 34.42,43.05 35.56,44.2 41.78,44.2 42.55,43.43 | 66.93,45.35 IC4.1 70.51,49.02 70.61,49.02 | X1.GND 76.96,32.56 77.98,33.58 X1.S1 79.63,33.62 79.63,35.81 80.64,36.83 C11.- | X1.S2 88.9,21.54 | 24.26,0.76 24.26,6.35 23.11,7.49 23.11,11.05 24.38,12.32 24.38,16.76 27.43,19.81 27.43,20.83 28.96,22.35 31.62,22.35 v32.38,23.11 | 36.32,0.76 36.32,9.91 34.33,11.9 C14.- | D3.A 53.72,0.76 | 88.9,20.07 88.9,19.81 82.55,19.81 81.79,19.05 77.72,19.05 77.47,18.8 J1.SHIELD0 | 52.66,17.82 52.66,22.14 v52.58,22.23
  Bottom 0.305: 88.9,37.59 88.9,0.76 75.82,0.76 62.93,0.76 51.18,0.76 46.48,0.76 9.4,0.76 | 88.9,37.59 88.9,42.42 | 88.9,42.42 88.9,49.02 85.98,49.02 | 26.8,37.85 C25.2 | 84.2,49.02 11.3,49.02 | 11.3,49.02 0.76,49.02 0.76,26.8 0.76,15.62 0.76,13.21 0.76,0.76 6.73,0.76 9.4,0.76 | v9.4,1.78 9.4,0.76 | R15.1 11.3,49.02 | R12.1 R11.1 40.95,39.56 41.66,38.86 v44.83,38.86 | C7.2 C6.2 C4.2 C5.2 45.59,40.64 | C28.2 v62.74,22.48 | LED1.K 88.9,37.59 | X1.GND 76.96,27.94 76.58,27.56 71.94,27.56 | LED3.K 85.98,49.02 | LED2.K 88.9,42.42 | C30.2 65.02,22.73 v64.77,22.48 | C31.2 C8.2 60.45,27.3 v60.71,27.56 60.33,27.56 59.44,28.45 58.42,28.45 58.04,28.83 58.04,29.84 58.17,29.97 58.17,34.8 | v84.2,48.26 84.2,49.02 | 84.2,49.02 85.98,49.02 | R10.2 59.75,38.73 v59.82,38.73
  Bottom 0.406: J1.SHIELD0 79.63,18.8 79.63,21.46 | X1.S2 79.67,21.59 79.63,21.59 79.63,23.88 79.63,27.05 77.85,28.83 76.96,28.83 X1.GND
  Bottom 0.61: 26.8,39.12 C25.2 | C10.2 18.86,19.36 v18.8,19.3 18.03,20.07 C9.2 | 26.8,39.12 22.99,39.12 21.72,37.85 C27.2 | C26.1 C40.1 14.99,10.41 12.45,10.41 11.94,10.92 7.11,10.92 X5.P$3 | 62.93,0.76 C36.2 61.85,3.17 61.34,3.68 61.34,10.16 61.85,10.67 C37.2 | X1.S1 77.93,33.58 74.74,36.76 R34.2 72.64,38.73 | 0.76,12.68 0.76,13.21 | 7.11,0.76 6.73,0.76 | 26.8,39.12 30.73,43.05 X2.3 | X5.P$3 | X5.P$3 X5.P$4 0.76,15.39 0.76,15.62 | X5.P$8 0.76,27.39 0.76,26.8 | v32.38,23.11 32.13,21.21 v34.16,19.18 34.1,19.24 R7.1 | 72.64,38.73 v59.82,38.73 59.18,38.1 v59.31,34.8 C32.2 | C17.2 75.06,39.37 74.42,38.73 72.64,38.73 | C41.2 C34.2 71.94,27.56 C35.2 C33.2 79.63,23.88 | C24.2 43.94,7.49 43.88,7.43 C24.2
  Bottom 0.813: C19.2 C20.2 | C22.2 C24.2 C23.2 50.1,7.56 51.18,6.48 51.18,0.76 | C21.2 C19.2 | C19.2 46.48,0.76 | C18.2 C17.2 | J1.SHIELD1 75.82,0.76 | C38.2 C39.2 77.4,13.53 75.82,15.11 75.82,16.26 | 75.82,16.26 J1.SHIELD0 | C3.1 C2.2 C1.2 38.17,23.31 v37.72,22.86 | JP2.1 32.13,23.2 v32.38,23.11 | J1.GND 70.99,15.24 72.01,16.26 v73.53,16.26 75.82,16.26 | v57.02,22.23 v52.58,22.23 49.53,22.23 49.53,23.24 49.4,23.37
  other vias: 49.4,38.86 47.12,42.42 47.12,35.31
  pour Top: 42.29,43.69 51.94,43.69 51.94,34.04 42.29,34.04
  pour Top (isolate 0.406): 59.44,28.32 66.04,28.32 66.04,21.72 59.44,21.72
  pour Bottom (isolate 0.406): 44.83,42.42 44.83,35.31 49.4,35.31 49.4,42.42
  pour Bottom (rank 3): 0,49.78 89.66,49.78 89.66,0 0,0
  pour Top (rank 3): 0,49.78 89.66,49.78 89.66,0 0,0
HC_KEY  (via drill 0.6)
  Top 0.305: IC1.41 46.87,45.34 47.5,45.97 v48.64,45.97
  Bottom 0.305: R16.1 13.84,42.67 14.86,41.66 19.68,41.66 25.4,47.37 47.24,47.37 v48.64,45.97
HC_RESET  (via drill 0.6)
  Top 0.305: 25.29,31.99 v25.27,32 25.27,33.9 U1.11 | IC1.43 45.87,46.38 v45.97,46.48
  Bottom 0.305: v25.27,32 24.26,33.02 R17.2 C27.1 21.66,35.05 20.45,35.05 20.19,35.31 20.19,37.59 29.46,46.86 45.59,46.86 v45.97,46.48
LED_LINK  (via drill 0.6)
  Top 0.305: IC7.28 63.99,31.48 v64.77,32.26
  Bottom 0.305: v64.77,32.26 64.9,32.13 67.94,32.13 69.47,33.66 75.18,33.66 82.68,26.16 82.68,20.32 81.66,19.3 81.66,12.32 81.92,12.06 R28.2
LEDACT_LINK  (via drill 0.6)
  Top 0.305: IC7.26 64.99,30.95 v65.02,30.99
  Bottom 0.305: v65.02,30.99 65.15,31.11 67.69,31.11 69.72,33.15 74.93,33.15 82.17,25.78 82.17,20.57 81.15,19.56 81.15,10.29 81.92,9.53 R29.2
N$1
  Top 0.305: IC1.5 45.37,29.11 Q1.2
  Bottom 0.305: C1.1 44.32,25.78 Q1.2
N$2
  Top 0.305: IC1.6 45.87,29.06 Q1.1
  Bottom 0.305: C2.1 46.86,25.78 Q1.1
N$3
  Top 0.305: IC1.60 39.78,37.11 38.86,36.2 38.86,33.15 36.45,30.73 R6.2
N$4  (via drill 0.6)
  Top 0.305: IC1.28 54.07,40.61 v54.36,40.89
  Bottom 0.305: v54.36,40.89 55.12,40.13 R10.1
N$5  (via drill 0.6)
  Top 0.305: U1.31 14.79,44.65 v16.38,43.05
  Bottom 0.305: v16.38,43.05 R14.1
N$6  (via drill 0.6)
  Top 0.305: IC1.35 49.87,46.18 v50.16,46.48
  Bottom 0.305: R21.1 80.01,44.58 77.22,47.37 51.05,47.37 v50.16,46.48
N$7  (via drill 0.6)
  Top 0.61: IC2.8 14.22,26.16 13.46,25.4 v13.46,24.89
  Bottom 0.61: v13.46,24.89 R2.1
N$8  (via drill 0.6)
  Top 0.61: v14.99,24.89 IC2.9
  Bottom 0.61: R1.1 15.75,24.13 v14.99,24.89
N$9
  Top 0.61: C12.1 39.4,20.35 IC3.1
N$10  (via drill 0.6)
  Top 0.305: U1.32 13.29,44.62 v14.86,43.05
  Bottom 0.305: v14.86,43.05 15.75,42.16 19.43,42.16 25.15,47.88 77.47,47.88 82.55,42.8 R13.2
N$11
  Bottom 0.305: R13.1 82.55,39.88 LED2.A
N$12
  Top 0.61: IC3.6 39.3,17.65 C12.2 44.01,18.1 DR2.P$1 46.78,20.87 D1.C
N$13  (via drill 0.6)
  Top 0.305: U1.24 25.29,45.73 22.61,43.05 v18.92,43.05
  Bottom 0.305: R9.1 v18.92,43.05
N$14
  Bottom 0.305: LED1.A 84.33,35.05 80.01,39.37 R21.2
N$16  (via drill 0.6)
  Top 0.305: IC7.29 63.49,32.27 v63.12,32.64
  Bottom 0.305: v63.12,32.64 63.5,33.02 R18.1
N$17  (via drill 0.6)
  Top 0.305: v74.04,20.7 73.03,21.72 73.03,22.86 69.85,26.04 68.45,26.04 68.19,25.77 IC7.20
  Bottom 0.305: R30.1 72.14,18.8 v74.04,20.7
N$18  (via drill 0.6)
  Top 0.61: DR1.P$1 v46.48,5.97
  Bottom 0.61: v46.48,5.97 C19.1
  Bottom 0.813: C21.1 C19.1 C20.1 42.99,4.38 42.16,3.56 40.09,3.56 F1.P$2 | F1.P$2 39.84,3.56 39.75,3.56 | F1.P$2 39.59,3.65 39.68,3.43
N$20  (via drill 0.6)
  Top 0.305: IC7.39 57.3,26.77 57.15,26.92 v57.15,27.43
  Bottom 0.305: v57.15,27.43 55.75,26.04 R20.2
N$21  (via drill 0.6)
  Top 0.305: v73.91,22.73 70.1,26.54 68.2,26.54 67.92,26.27 IC7.21
  Bottom 0.305: R31.1 72.52,21.34 v73.91,22.73
N$22
  Bottom 0.305: R29.1 84.52,7.55 J1.G-
N$23
  Bottom 0.305: R28.1 84.52,14.04 J1.Y-
N$25  (via drill 0.6)
  Top 0.305: v9.02,47.24 9.95,47.24 U1.34
  Bottom 0.305: v9.02,47.24 9.02,45.72 9.84,44.9 R15.2 11.62,44.9 13.52,46.8 R16.2
N$26  (via drill 0.6)
  Top 0.305: v67.56,33.02 66.89,32.34 IC7.24
  Bottom 0.305: 68.01,34.8 R32.1 68.07,33.53 v67.56,33.02
N$27
  Bottom 0.305: R32.2 R33.2
N$28
  Bottom 0.305: R33.1 R34.1
N$29
  Top 0.305: JP2.2 33.53,26.92 35.5,28.89 R6.1
N$33
  Bottom 0.305: R14.2 R9.2 18.92,47.75 19.56,48.39 82.3,48.39 LED3.A
NRST  (via drill 0.6)
  Top 0.305: IC1.7 46.37,30.98 v47.5,29.84
  Bottom 0.305: v47.5,29.84 49.4,27.94 C3.2
PC2  (via drill 0.6)
  Top 0.305: IC1.10 47.87,32.02 v48.51,31.37 | v27.94,6.86 28.45,7.37 28.45,9.65 27.3,10.79 27.3,15.49 31.75,19.94 32.64,19.94 37.34,24.64 38.61,24.64 40.39,26.42 40.39,28.83 v41.66,30.1
  Bottom 0.305: X5.P$2 8.64,7.87 8.64,5.97 11.94,2.67 23.75,2.67 v27.94,6.86 | v41.66,30.1 42.93,31.37 v48.51,31.37
PC3  (via drill 0.6)
  Top 0.305: v43.43,30.1 42.8,30.1 40.89,28.19 40.89,26.16 38.86,24.13 37.59,24.13 32.89,19.43 32,19.43 27.81,15.24 27.81,11.05 28.96,9.91 28.96,7.11 v29.21,6.86 | IC1.11 48.37,32.41 48.64,32.13 49.02,32.13 v49.78,31.37
  Bottom 0.305: X5.P$1 11.35,2.16 24.51,2.16 v29.21,6.86 | v43.43,30.1 43.94,30.61 49.02,30.61 v49.78,31.37
PC14  (via drill 0.6)
  Top 0.305: v25.15,7.62 25.15,9.27 25.78,9.91 25.78,16.26 28.7,19.18 28.7,20.19 29.59,21.08 32.26,21.08 36.83,25.65 38.1,25.65 39.37,26.92 39.37,29.84 41.02,31.5 43.81,31.5 44.37,32.05 IC1.3
  Bottom 0.305: X5.P$10 11.43,8.07 11.43,5.71 13.46,3.68 21.21,3.68 v25.15,7.62
PC15  (via drill 0.6)
  Top 0.305: v25.91,6.48 25.91,9.27 26.29,9.65 26.29,16 29.21,18.92 29.21,19.94 29.84,20.57 32.51,20.57 37.08,25.15 38.35,25.15 39.88,26.67 39.88,29.59 41.27,30.99 44.07,30.99 44.87,31.79 IC1.4
  Bottom 0.305: X5.P$9 10.11,6.27 13.21,3.17 22.61,3.17 v25.91,6.48
PFB  (via drill 0.6)
  Top 0.305: IC7.18 68.46,24.77 v68.83,25.15 | IC7.23 67.91,27.27 v68.33,27.69 | IC7.37 58.59,29.29 58.89,29.59 v58.93,29.59
  Bottom 0.305: 70.04,25.15 C35.1 70.04,27.69 | 70.04,25.15 C33.1 | 70.04,27.69 v68.33,27.69 68.33,28.83 67.56,29.59 v58.93,29.59 59.31,29.97 C32.1 | 70.04,27.69 C34.1 | v68.83,25.15 70.04,25.15
RD+
  Top 0.305: IC7.14 68.04,22.77 71.75,19.05 71.75,16.76 73.91,14.61 73.91,9.53 73.28,8.89 J1.RD+
  Bottom 0.305: R26.2 69.15,8.89 J1.RD+
RD-
  Top 0.305: J1.RD- 69.85,13.34 71.25,14.73 71.25,18.8 67.77,22.27 IC7.13
  Bottom 0.305: R27.1 66.55,16 J1.RD-
RMII_CRS_DV  (via drill 0.6)
  Top 0.305: IC1.23 53.71,38.11 v54.36,37.47 | IC7.40 57.04,26.27 56.26,27.05 56.26,27.77 57.4,28.92 57.4,30.73 56.64,31.5 v56.39,31.5
  Bottom 0.305: R19.2 53.09,27.94 55.63,30.48 55.63,30.73 v56.39,31.5 56.64,31.75 56.64,35.69 54.86,37.47 v54.36,37.47
RMII_MDC
  Top 0.305: IC7.31 62.49,30.22 62.48,30.23 62.48,31.24 61.59,32.13 57.02,32.13 56.9,32.26 56.01,32.26 55.37,31.62 51.31,31.62 50.29,30.61 48.01,30.61 47.37,31.25 IC1.9
RMII_MDIO
  Top 0.305: IC7.30 62.99,30.22 62.99,30.23 62.99,31.62 61.59,33.02 61.59,33.4 61.09,33.91 56.13,33.91 54.86,32.64 50.93,32.64 50.87,32.7 IC1.16
RMII_REF_CLK  (via drill 0.6)
  Top 0.305: IC1.15 50.37,32.18 50.42,32.13 55.12,32.13 56.01,33.02 v60.71,33.02 | v60.71,37.59 60.96,37.85 QG1.3 | IC7.34 60.99,30.07 60.71,30.35 v60.71,31.24
  Bottom 0.305: v60.71,31.24 v60.71,33.02 v60.71,37.59
RMII_RXD0  (via drill 0.6)
  Top 0.305: IC1.24 53.98,38.61 v54.36,38.61 | IC7.43 57.53,24.77 55.75,26.54 55.75,28.07 56.52,28.83 v56.52,30.23
  Bottom 0.305: v54.36,38.61 57.15,35.94 57.15,30.86 v56.52,30.23
RMII_RXD1  (via drill 0.6)
  Top 0.305: IC1.25 53.72,39.11 v54.36,39.75 | IC7.44 57.27,24.27 55.24,26.29 55.24,28.83 v55.63,29.21
  Bottom 0.305: v54.36,39.75 57.66,36.45 57.66,30.1 56.77,29.21 v55.63,29.21
RMII_TX_EN  (via drill 0.6)
  Top 0.305: IC7.2 60.49,19.85 60.2,19.56 58.42,19.56 56.13,21.84 56.13,24.64 54.74,26.04 v54.74,30.73 | v54.36,36.32 55.12,37.08 55.12,41.4 54.74,41.78 53.98,41.78 53.8,41.61 IC1.30
  Bottom 0.305: v54.74,30.73 54.74,31.75 56.13,33.15 56.13,35.43 55.24,36.32 v54.36,36.32
RMII_TXD0  (via drill 0.6)
  Top 0.305: IC7.3 60.99,19.59 60.45,19.05 58.17,19.05 55.63,21.59 55.63,24.38 54.23,25.78 54.23,29.97 v53.47,30.73 | IC1.33 50.87,45.28 51.18,45.59 54.48,45.59 55.63,44.45 55.63,36.2 v54.61,35.18
  Bottom 0.305: v53.47,30.73 53.47,31.24 55.63,33.4 55.63,34.67 55.12,35.18 v54.61,35.18
RMII_TXD1  (via drill 0.6)
  Top 0.305: IC7.4 61.49,19.32 60.71,18.54 57.91,18.54 55.12,21.34 55.12,24.13 53.72,25.53 53.72,29.21 v52.2,30.73 | IC1.34 50.37,45.54 50.93,46.1 54.74,46.1 56.13,44.7 56.13,35.56 54.61,34.04 v54.36,34.04
  Bottom 0.305: v52.2,30.73 52.2,31.88 v54.36,34.04
SWCLK
  Top 0.305: IC1.49 35.49,42.61 X2.2
SWDIO
  Top 0.305: IC1.46 44.37,45.42 44.2,45.59 X2.4
TD+
  Top 0.305: J1.TD+ 74.93,8.89 74.93,17.14 73.91,18.16 73.91,19.3 68.82,24.27 IC7.17
  Bottom 0.305: R24.2 71.75,5.71 J1.TD+
TD-
  Top 0.305: J1.TD- 72.77,7.62 74.42,9.27 74.42,16.89 73.41,17.91 73.41,19.05 68.56,23.77 IC7.16
  Bottom 0.305: R25.1 69.34,8.13 J1.TD-
TJA_EN  (via drill 0.6)
  Top 0.305: IC1.55 37.58,39.61 v37.21,39.24 36.32,38.35 36.32,36.32 24.89,24.89 IC2.6
  Bottom 0.305: v37.21,39.24 37.21,41.53 38.35,42.67 R12.2
TJA_ERR  (via drill 0.6)
  Top 0.305: IC2.4 23.88,22.35 34.92,33.4 v35.43,33.4 | IC1.59 39.52,37.61 38.35,36.45 38.35,33.91 v37.85,33.4
  Bottom 0.305: R23.1 38.99,34.92 38.99,34.54 v37.85,33.4 v35.43,33.4
TJA_INH  (via drill 0.6)
  Top 0.305: v25.27,20.83 22.99,18.54 IC2.1 | SW1.1 26.8,9.06 26.8,15.75 30.1,19.05 v30.1,19.68
  Bottom 0.305: v25.27,20.83 28.96,20.83 v30.1,19.68
TJA_STB  (via drill 0.6)
  Top 0.305: IC2.5 24.38,23.62 36.83,36.07 36.83,37.21 37.34,37.72 v37.34,38.1 38.35,39.11 IC1.56
  Bottom 0.305: v37.34,38.1 39.05,39.82 R11.2
TJABAT  (via drill 0.6)
  Top 0.61: IC2.14 16.96,17.97 v16.38,17.4
  Bottom 0.61: v16.38,17.4 21.46,17.4 | 21.46,17.4 23.75,17.4 | C10.1 21.46,17.4 | R3.2 23.82,17.46 23.75,17.4 | 23.75,17.4 24.26,17.4 24.32,17.46 R4.1
TJAWAKE  (via drill 0.6)
  Top 0.305: IC2.7 v20.07,26.16
  Bottom 0.305: R3.1 24,22.23 v20.07,26.16
UART4_RX
  Top 0.305: IC1.52 36.03,41.11 35.31,40.39 35.31,39.62 34.8,39.12 34.8,37.08 26.67,28.96 14.1,28.96 10.29,32.77 U1.1
UART4_TX
  Top 0.305: IC1.51 35.77,41.61 34.8,40.64 34.8,39.88 34.16,39.24 32.77,39.24 31.88,38.35 31.88,34.92 26.42,29.46 14.48,29.46 11.81,32.13 11.81,33.88 U1.2
UART5_RX
  Top 0.305: IC1.54 36.81,40.11 36.32,39.62 36.32,39.12 35.81,38.61 35.81,36.58 27.18,27.94 13.66,27.94 X5.P$15
UART5_TX
  Top 0.305: IC1.53 36.29,40.61 35.81,40.13 35.81,39.37 35.31,38.86 35.31,36.83 26.92,28.45 13.46,28.45 10.92,25.91 8.64,25.91 X5.P$7
USB_D+
  Top 0.305: X1.D+ 76.96,27.56 73.91,27.56 73.53,27.94 73.53,33.78 70.61,36.7 60.33,36.7 57.66,39.37 57.66,45.47 54.74,48.39 45.97,48.39 44.58,46.99 44.58,45.97 44.87,45.68 IC1.45
USB_D-
  Top 0.305: X1.D- 74.94,26.29 73.91,26.29 73.03,27.18 73.03,33.53 70.36,36.2 60.07,36.2 57.15,39.12 57.15,45.21 54.48,47.88 46.23,47.88 45.09,46.74 45.09,46.23 45.37,45.95 IC1.44
USB_VBUS  (via drill 0.6)
  Top 0.305: IC1.42 46.37,45.6 48.13,47.37 54.23,47.37 56.64,44.96 56.64,38.86 59.82,35.69 68.33,35.69 68.58,35.43 v68.58,30.61
  Top 0.406: X1.VBUS 74.93,28.81
  Top 0.813: 74.93,28.81 D4.A
  Bottom 0.305: 74.93,29.84 74.93,28.84 X1.VBUS 74.96,29.3 74.93,29.34 74.93,31.24 73.53,32.64 70.36,32.64 70.04,32.32 C41.1 69.47,31.5 v68.58,30.61

### Text on the board
tPlace: IO | + | GND | CLK | + | 3.3 | + | GND | 3.3 | TX | RX | FTL | FTH | HSL | HSH | GND | +12 | GND | 3.3 | C2 | C14 | C3 | C15
bPlace: https://github.com/autowp/CANreader-XL | v0.2 | CANreader-XL
bNames: GND | TX | RX | 3.3 | FTL | FTH | HSL | HSH | GND | +12